# Altium schematic sheet Power Suplay.SchDoc
size 101 x 38 mm
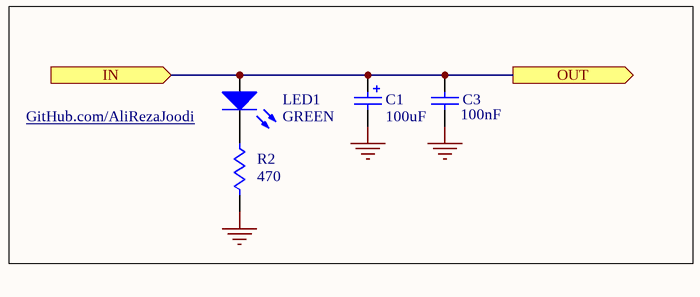
[diagram p0: Power Suplay.SchDoc]

## Parts
C1  100uF  [CAPPR2.5-6.3x5]
C3  100nF  [CAPNTO2.54-3.05x1.78A]
LED1  GREEN  [LED-5mm_Red]
R2  470  [AXIAL-0.4]

## Ports
IN (in), OUT (out)

## Nets
GND: C1.2 C3.1 R2.2
IN: C1.1 C3.2 LED1.1(A) ; port IN, port OUT
NetLED1_2: LED1.2(K) R2.1

## Notes on the sheet
- GitHub.com/AliRezaJoodi

## Library data of the parts
C1 = Cap Pol1: Polarized Capacitor (Radial); Manufacturer: Generic Components; Class I: Passive; Published: 8-Jun-2000; Revision: July-2002: Re-released for DXP Platform.; Publisher: Altium Limited; Class II: Capacitor
C3 = Cap: Capacitor; Manufacturer: Generic Components; Class I: Passive; Published: 8-Jun-2000; Revision: July-2002: Re-released for DXP Platform.; Publisher: Altium Limited; Class II: Capacitor; Value: 100nF
LED1 = LED: Typical INFRARED GaAs LED; Manufacturer: Generic Components; Class I: Optoelectronic; Published: 8-Jun-2000; Revision: July-2002: Re-released for DXP Platform.; Publisher: Altium Limited; Class II: LED
R2 = Res1: Resistor; Manufacturer: Generic Components; Class I: Passive; Published: 8-Jun-2000; Revision: July-2002: Re-released for DXP Platform.; Publisher: Altium Limited; Class II: Resistor